# Altium schematic sheet Main_sheet.SchDoc
size A3; SheetNumber: 1; SheetTotal: 6
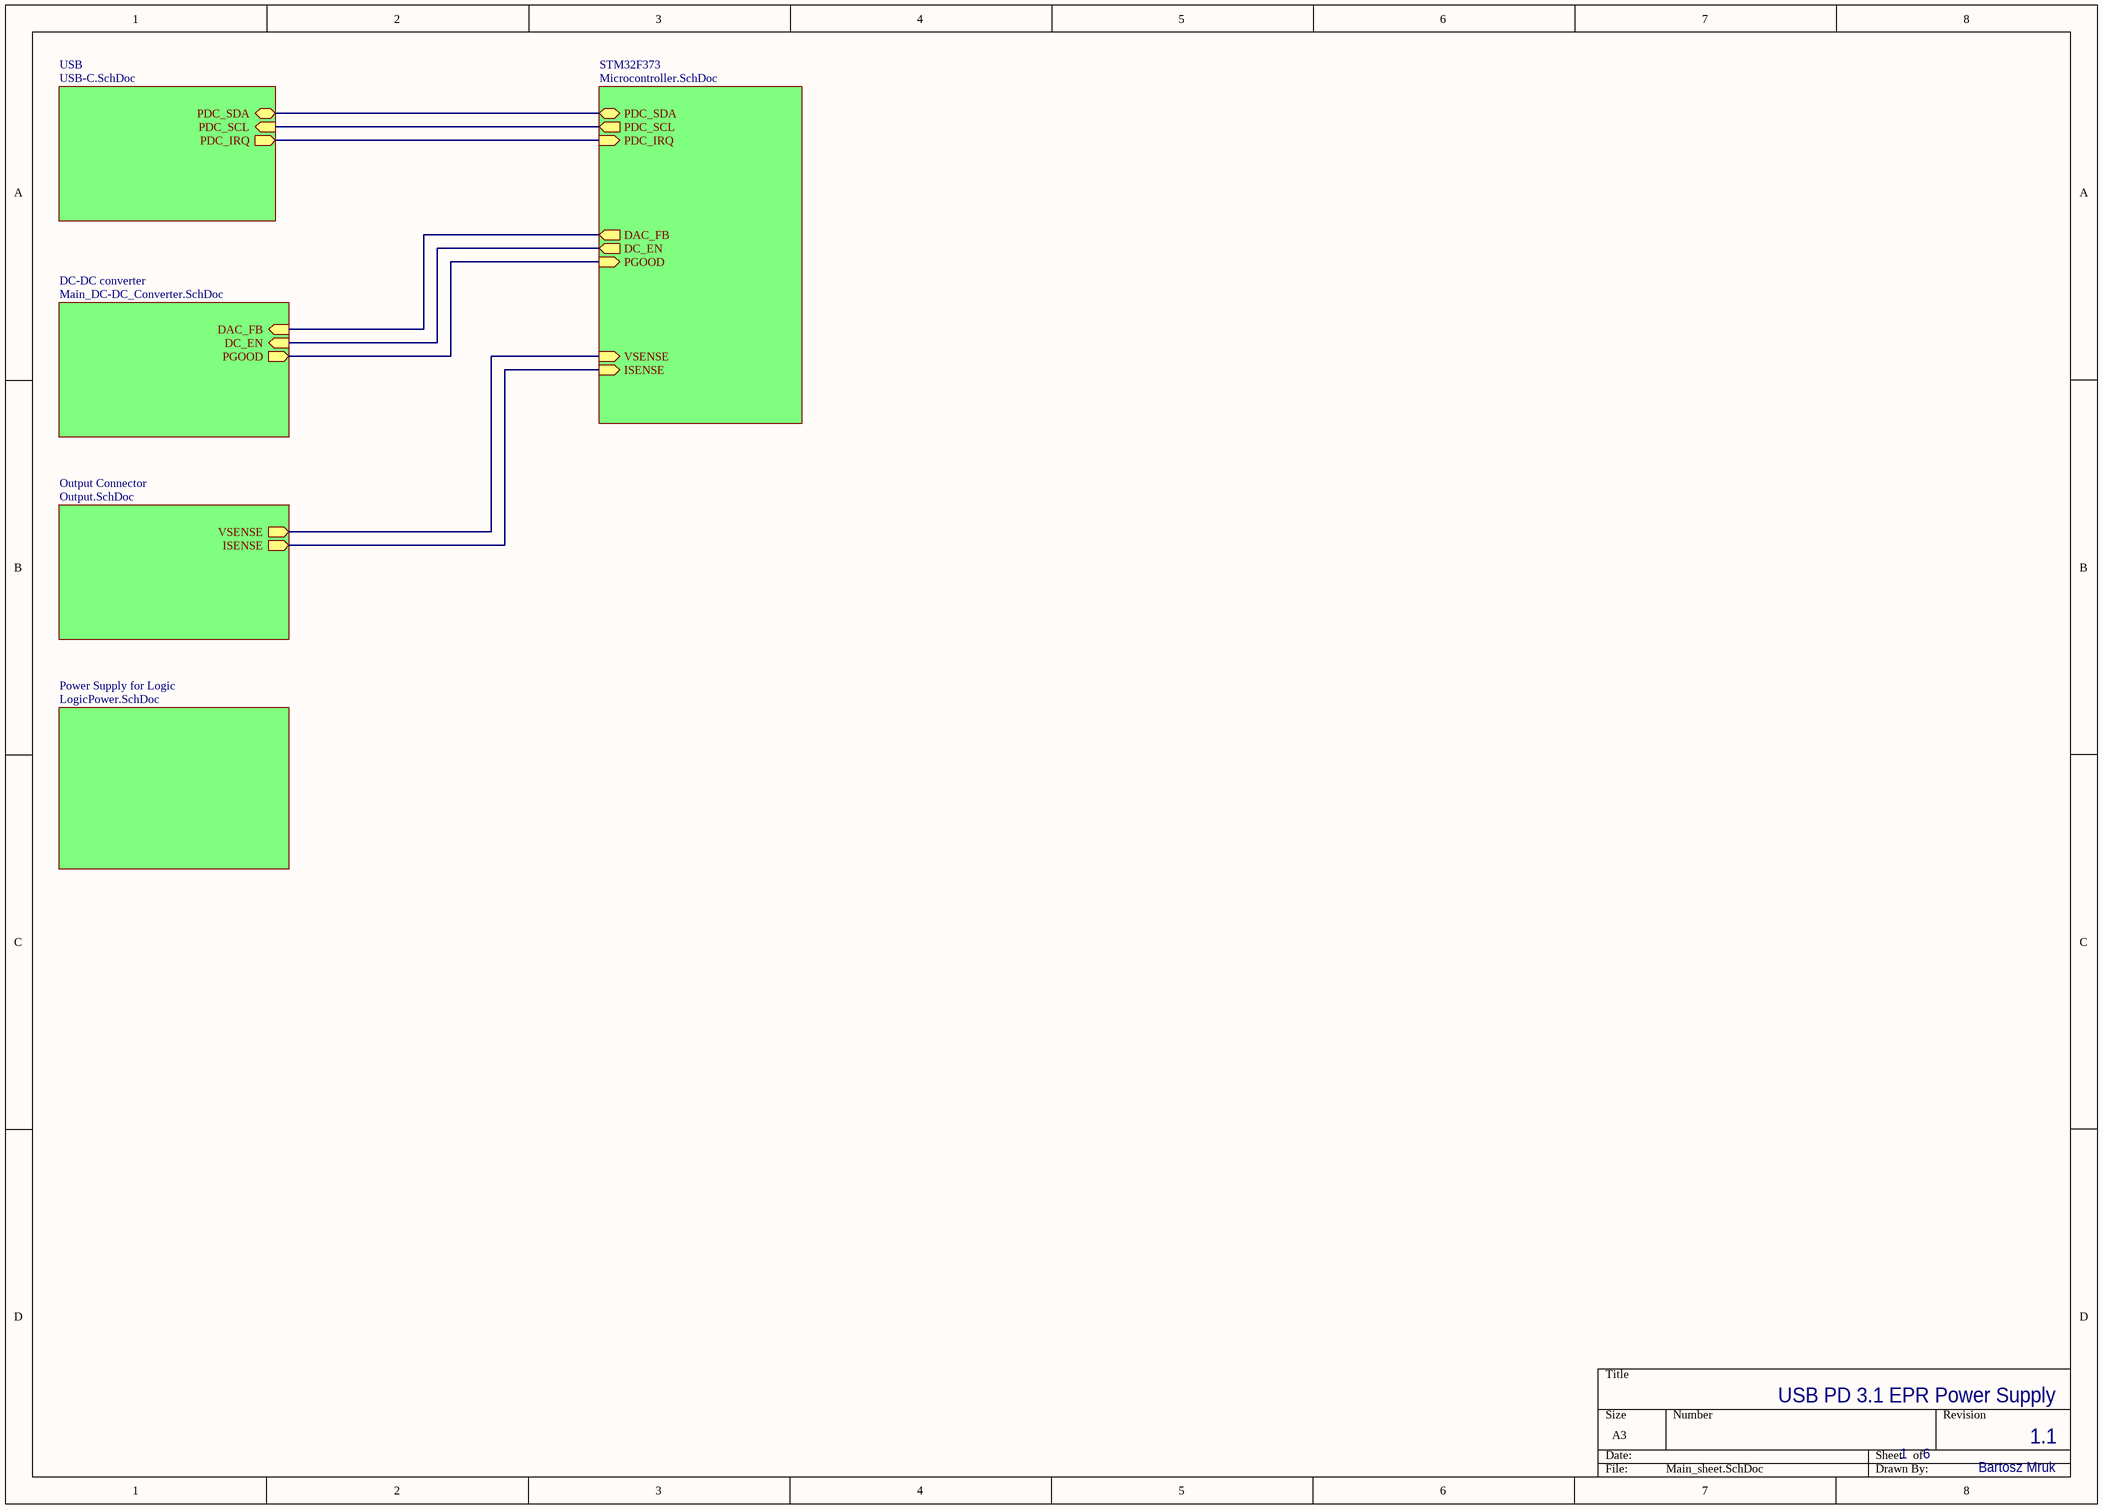
[diagram p0: Main_sheet.SchDoc]

## Sub-sheets
DC-DC converter = Main_DC-DC_Converter.SchDoc: DAC_FB (in), DC_EN (in), PGOOD (out)
Output Connector = Output.SchDoc: VSENSE (out), ISENSE (out)
Power Supply for Logic = LogicPower.SchDoc: no entries
STM32F373 = Microcontroller.SchDoc: PDC_SDA (bidir), PDC_SCL (out), VSENSE (in), ISENSE (in), DAC_FB (out), PDC_IRQ (in), DC_EN (out), PGOOD (in)
USB = USB-C.SchDoc: PDC_SDA (bidir), PDC_SCL (in), PDC_IRQ (out)

## Nets
(unnamed): sheet USB/PDC_SDA, sheet STM32F373/PDC_SDA
(unnamed): sheet USB/PDC_SCL, sheet STM32F373/PDC_SCL
(unnamed): sheet USB/PDC_IRQ, sheet STM32F373/PDC_IRQ
(unnamed): sheet STM32F373/VSENSE, sheet Output Connector/VSENSE
(unnamed): sheet STM32F373/ISENSE, sheet Output Connector/ISENSE
(unnamed): sheet STM32F373/DAC_FB, sheet DC-DC converter/DAC_FB
(unnamed): sheet STM32F373/DC_EN, sheet DC-DC converter/DC_EN
(unnamed): sheet STM32F373/PGOOD, sheet DC-DC converter/PGOOD

## Notes on the sheet
- 1
- 6
- 1.1
- USB PD 3.1 EPR Power Supply
- Bartosz Mruk